# EAGLE design pi-io-board (EAGLE 6.4)
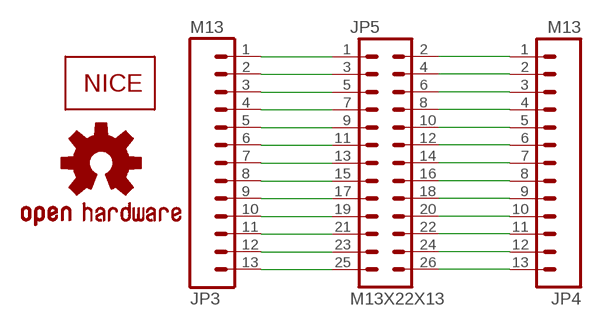
[diagram p0: schematic, sheet 1]

## Parts
JP3  M13  [1X13]
JP4  M13  [1X13]
JP5  M13X22X13  [2X13]
LOGO1  OSHW-LOGOS  [OSHW-LOGO-S]
U$1  NICE-LOGO04  [NICE-LOGO-04]

## Nets
N$1: JP3.1 JP5.1
N$2: JP3.2 JP5.3
N$3: JP3.3 JP5.5
N$4: JP3.4 JP5.7
N$5: JP3.5 JP5.9
N$6: JP3.6 JP5.11
N$7: JP3.7 JP5.13
N$8: JP3.8 JP5.15
N$9: JP3.9 JP5.17
N$10: JP3.10 JP5.19
N$11: JP3.11 JP5.21
N$12: JP3.12 JP5.23
N$13: JP3.13 JP5.25
N$14: JP4.1 JP5.2
N$15: JP4.2 JP5.4
N$16: JP4.3 JP5.6
N$17: JP4.4 JP5.8
N$18: JP4.5 JP5.10
N$19: JP4.6 JP5.12
N$20: JP4.7 JP5.14
N$21: JP4.8 JP5.16
N$22: JP4.9 JP5.18
N$23: JP4.10 JP5.20
N$24: JP4.11 JP5.22
N$25: JP4.12 JP5.24
N$26: JP4.13 JP5.26

## Library data of the parts
JP3 JP4 = 0_hads:M13
JP5 = SparkFun-Connectors:M13X2: 0.1" spaced headers
LOGO1 = SparkFun-Aesthetics:OSHW-LOGO: Open Source Hardware Logo This logo indicates the piece of hardware it is found on incorporates a OSHW license and/or adheres to the definition of open source hardware found here: http://freedomdefined.org/OSHW
U$1 = 0_hads:NICE-LOGO

## Board
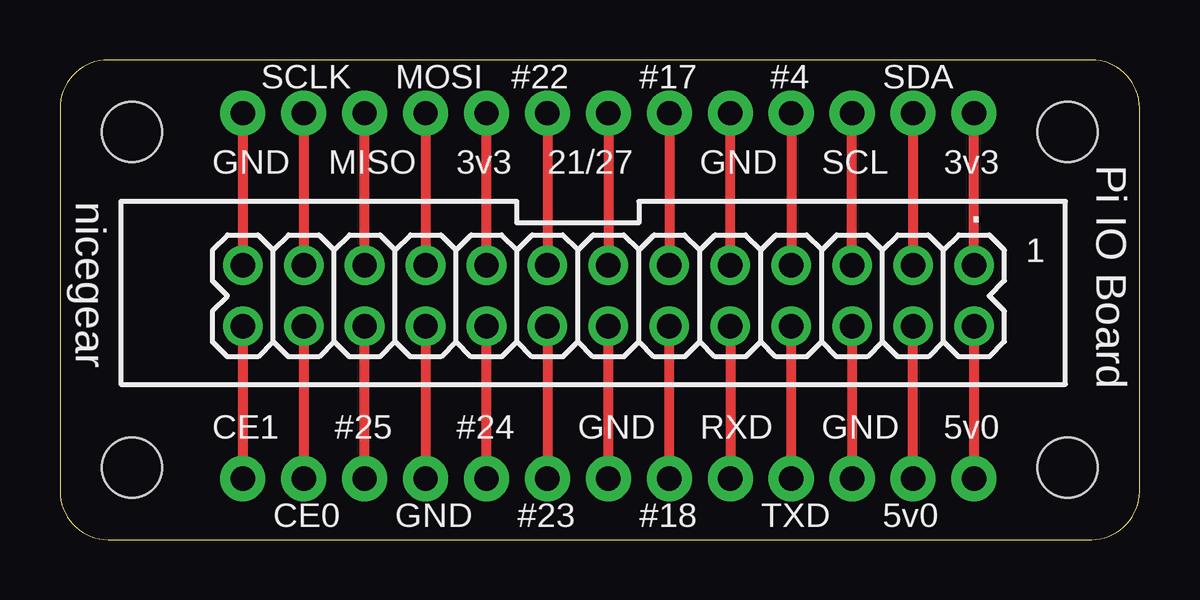
[diagram p1: board, top side]
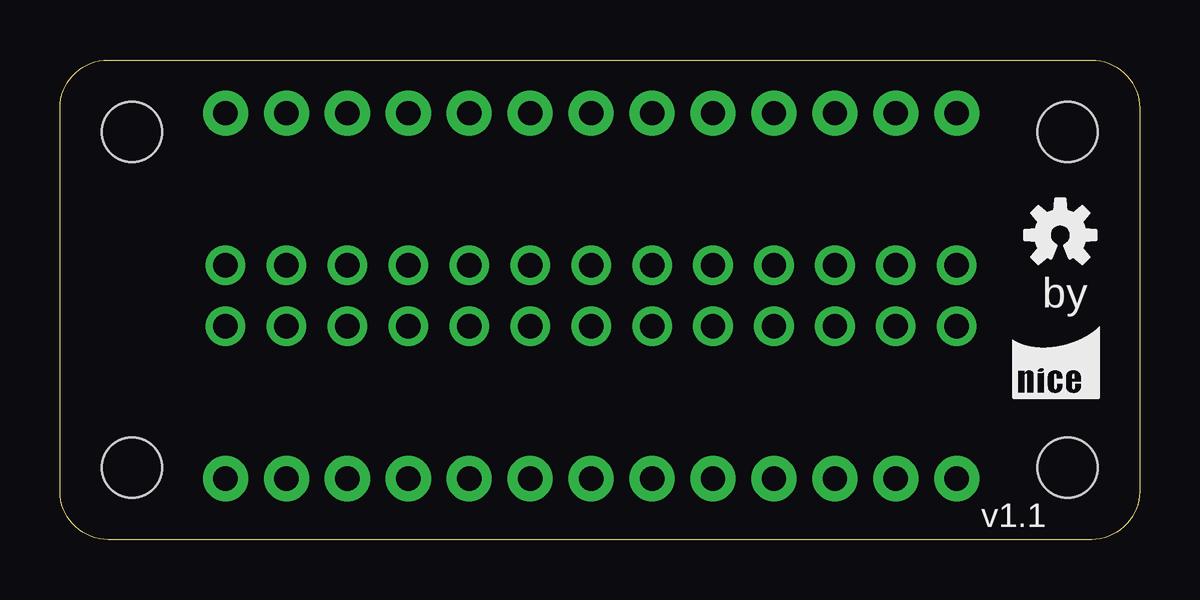
[diagram p2: board, bottom side, seen from below]

Size 45 x 20 mm. Coordinates in mm from the lower left corner, seen from the top.
Outline: 0,18 0,2 arc90 2,0 43,0 arc90 45,2 45,18 arc90 43,20 2,20 arc90 0,18
Copper layers (1*16): Top 0.035mm / dielectric 1.5mm / Bottom 0.035mm
Design rules "default": minimum track width 10mil, minimum drill 24mil, track to track 8mil, track to pad 8mil, pad to pad 8mil, via to via 8mil, smd to smd 8mil, copper to edge 40mil, drill to drill 8mil, minimum pad ring 10mil, minimum via ring 8mil, stop-mask expansion 4mil, vias tented up to drill 0mil, thermal gap 10mil
Holes 2.5 mm at 3,17 42,17 42,3 3,3

### Footprints (pad centres in the part's own frame; a part is rotated, then mirrored left to right if it is on the bottom)
1X13 = drill 1.016 pad 1.88: 1 0,0; 2 2.54,0; 3 5.08,0; 4 7.62,0; 5 10.16,0; 6 12.7,0; 7 15.24,0; 8 17.78,0; 9 20.32,0; 10 22.86,0; 11 25.4,0; 12 27.94,0; 13 30.48,0
2X13 = drill 1.016 pad 1.651: 1 0,0; 2 0,2.54; 3 2.54,0; 4 2.54,2.54; 5 5.08,0; 6 5.08,2.54; 7 7.62,0; 8 7.62,2.54; 9 10.16,0; 10 10.16,2.54; 11 12.7,0; 12 12.7,2.54; 13 15.24,0; 14 15.24,2.54; 15 17.78,0; 16 17.78,2.54; 17 20.32,0; 18 20.32,2.54; 19 22.86,0; 20 22.86,2.54; 21 25.4,0; 22 25.4,2.54; 23 27.94,0; 24 27.94,2.54; 25 30.48,0; 26 30.48,2.54

### Placement (x,y rotation side)
JP3  38.1,17.78 180 top
JP4  38.1,2.54 180 top
JP5  38.1,11.43 180 top
LOGO1  3.3,12.7 0 bottom
U$1  4.57,6.86 0 bottom

### Tracks (layer width: path | path; a pad name or v marks a point on that pad's centre or on a via)
N$1
  Top 0.406: JP5.1 JP3.1
N$2
  Top 0.406: JP3.2 JP5.3
N$3
  Top 0.406: JP5.5 JP3.3
N$4
  Top 0.406: JP3.4 JP5.7
N$5
  Top 0.406: JP5.9 JP3.5
N$6
  Top 0.406: JP3.6 JP5.11
N$7
  Top 0.406: JP3.7 JP5.13
N$8
  Top 0.406: JP3.8 JP5.15
N$9
  Top 0.406: JP5.17 JP3.9
N$10
  Top 0.406: JP3.10 JP5.19
N$11
  Top 0.406: JP5.21 JP3.11
N$12
  Top 0.406: JP3.12 JP5.23
N$13
  Top 0.406: JP3.13 JP5.25
N$14
  Top 0.406: JP5.2 JP4.1
N$15
  Top 0.406: JP4.2 JP5.4
N$16
  Top 0.406: JP5.6 JP4.3
N$17
  Top 0.406: JP4.4 JP5.8
N$18
  Top 0.406: JP5.10 JP4.5
N$19
  Top 0.406: JP4.6 JP5.12
N$20
  Top 0.406: JP4.7 JP5.14
N$21
  Top 0.406: JP5.16 JP4.8
N$22
  Top 0.406: JP4.9 JP5.18
N$23
  Top 0.406: JP5.20 JP4.10
N$24
  Top 0.406: JP4.11 JP5.22
N$25
  Top 0.406: JP5.24 JP4.12
N$26
  Top 0.406: JP5.26 JP4.13

### Text on the board
tPlace: SCLK | MOSI | #22 | #17 | #4 | SDA | Pi IO Board | GND | MISO | 3v3 | 21/27 | GND | SCL | 3v3 | nicegear | . | 1 | CE1 | #25 | #24 | GND | RXD | GND | 5v0 | CE0 | GND | #23 | #18 | TXD | 5v0
bPlace: by | v1.1